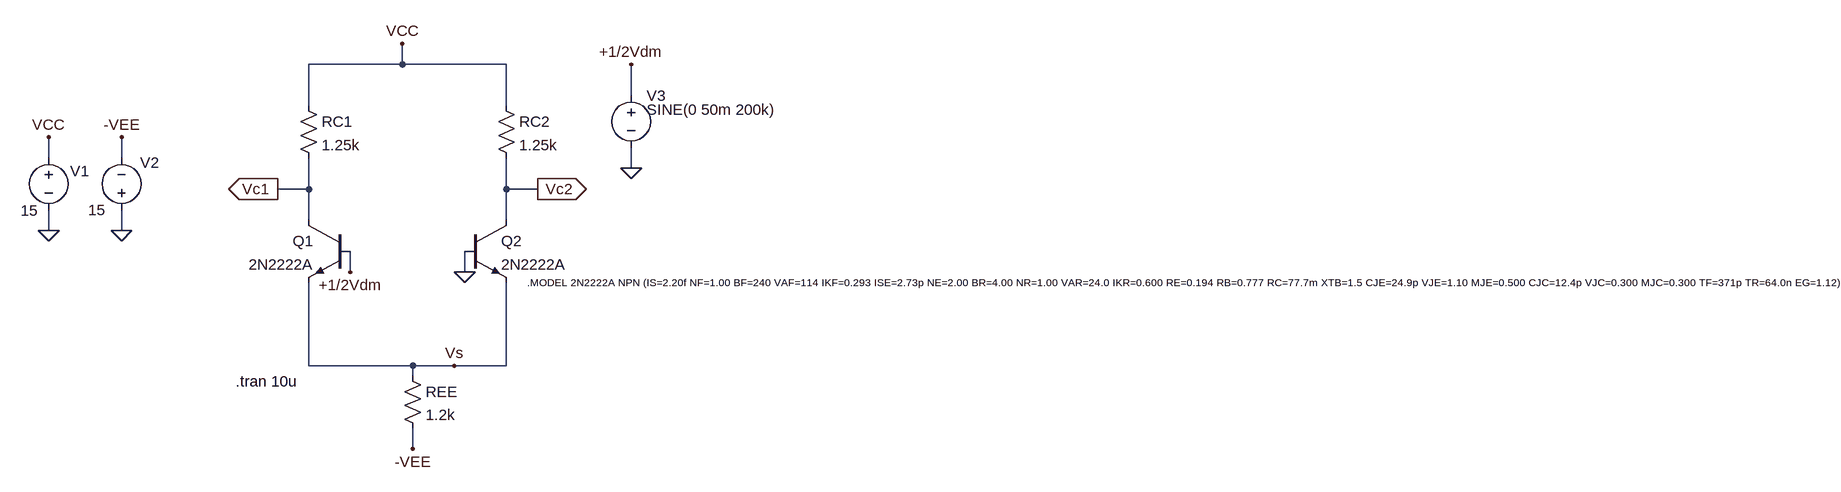
[diagram p0: schematic LongTailDM.asc]
LongTailDM.asc, the LTspice schematic file:
Version 4
SHEET 1 2568 848
WIRE 400 144 400 112
WIRE 400 144 256 144
WIRE 560 144 400 144
WIRE 752 192 752 144
WIRE 256 208 256 144
WIRE 560 208 560 144
WIRE -144 288 -144 256
WIRE -32 288 -32 256
WIRE 752 304 752 272
WIRE 256 336 256 288
WIRE 256 336 208 336
WIRE 560 336 560 288
WIRE 608 336 560 336
WIRE 256 384 256 336
WIRE 560 384 560 336
WIRE -144 400 -144 368
WIRE -32 400 -32 368
WIRE 320 464 320 432
WIRE 496 464 496 432
WIRE 256 608 256 480
WIRE 416 608 256 608
WIRE 480 608 416 608
WIRE 560 608 560 480
WIRE 560 608 480 608
WIRE 416 624 416 608
WIRE 416 736 416 704
FLAG 608 336 Vc2
IOPIN 608 336 Out
FLAG 208 336 Vc1
IOPIN 208 336 Out
FLAG 400 112 VCC
FLAG 416 736 -VEE
FLAG -32 400 0
FLAG -144 400 0
FLAG -144 256 VCC
FLAG -32 256 -VEE
FLAG 480 608 Vs
FLAG 752 144 +1/2Vdm
FLAG 320 464 +1/2Vdm
FLAG 752 304 0
FLAG 496 464 0
SYMBOL res 240 192 R0
SYMATTR InstName RC1
SYMATTR Value 1.25k
SYMBOL res 544 192 R0
SYMATTR InstName RC2
SYMATTR Value 1.25k
SYMBOL res 400 608 R0
SYMATTR InstName REE
SYMATTR Value 1.2k
SYMBOL npn 320 384 M0
SYMATTR InstName Q1
SYMATTR Value 2N2222A
SYMBOL npn 496 384 R0
SYMATTR InstName Q2
SYMATTR Value 2N2222A
SYMBOL voltage -144 272 R0
WINDOW 0 33 36 Left 2
WINDOW 3 -43 97 Left 2
SYMATTR InstName V1
SYMATTR Value 15
SYMATTR SpiceLine Rser=0
SYMBOL voltage -32 384 R180
WINDOW 0 -58 89 Left 2
WINDOW 3 24 16 Left 2
SYMATTR InstName V2
SYMATTR Value 15
SYMATTR SpiceLine Rser=0
SYMBOL voltage 752 176 R0
WINDOW 3 24 38 Left 2
WINDOW 123 23 111 Left 2
SYMATTR Value SINE(0 50m 200k)
SYMATTR InstName V3
TEXT 144 632 Left 2 !.tran 10u
TEXT 592 480 Left 1 !.MODEL 2N2222A NPN (IS=2.20f NF=1.00 BF=240 VAF=114 IKF=0.293 ISE=2.73p NE=2.00 BR=4.00 NR=1.00 VAR=24.0 IKR=0.600 RE=0.194 RB=0.777 RC=77.7m XTB=1.5 CJE=24.9p VJE=1.10 MJE=0.500 CJC=12.4p VJC=0.300 MJC=0.300 TF=371p TR=64.0n EG=1.12)

The netlist it stands for:
* LongTailDM.asc
RC1 VCC Vc1 1.25k
RC2 VCC Vc2 1.25k
REE Vs -VEE 1.2k
Q1 Vc1 +1/2Vdm Vs 0 2N2222A
Q2 Vc2 0 Vs 0 2N2222A
V1 VCC 0 15 Rser=0
V2 0 -VEE 15 Rser=0
V3 +1/2Vdm 0 SINE(0 50m 200k)
.model NPN NPN
.model PNP PNP
.lib standard.bjt
.tran 10u
.MODEL 2N2222A NPN (IS=2.20f NF=1.00 BF=240 VAF=114 IKF=0.293 ISE=2.73p NE=2.00 BR=4.00 NR=1.00 VAR=24.0 IKR=0.600 RE=0.194 RB=0.777 RC=77.7m XTB=1.5 CJE=24.9p VJE=1.10 MJE=0.500 CJC=12.4p VJC=0.300 MJC=0.300 TF=371p TR=64.0n EG=1.12)
.backanno
.end